# EAGLE design SwitchBoard_MP3 (EAGLE 9.6.2)
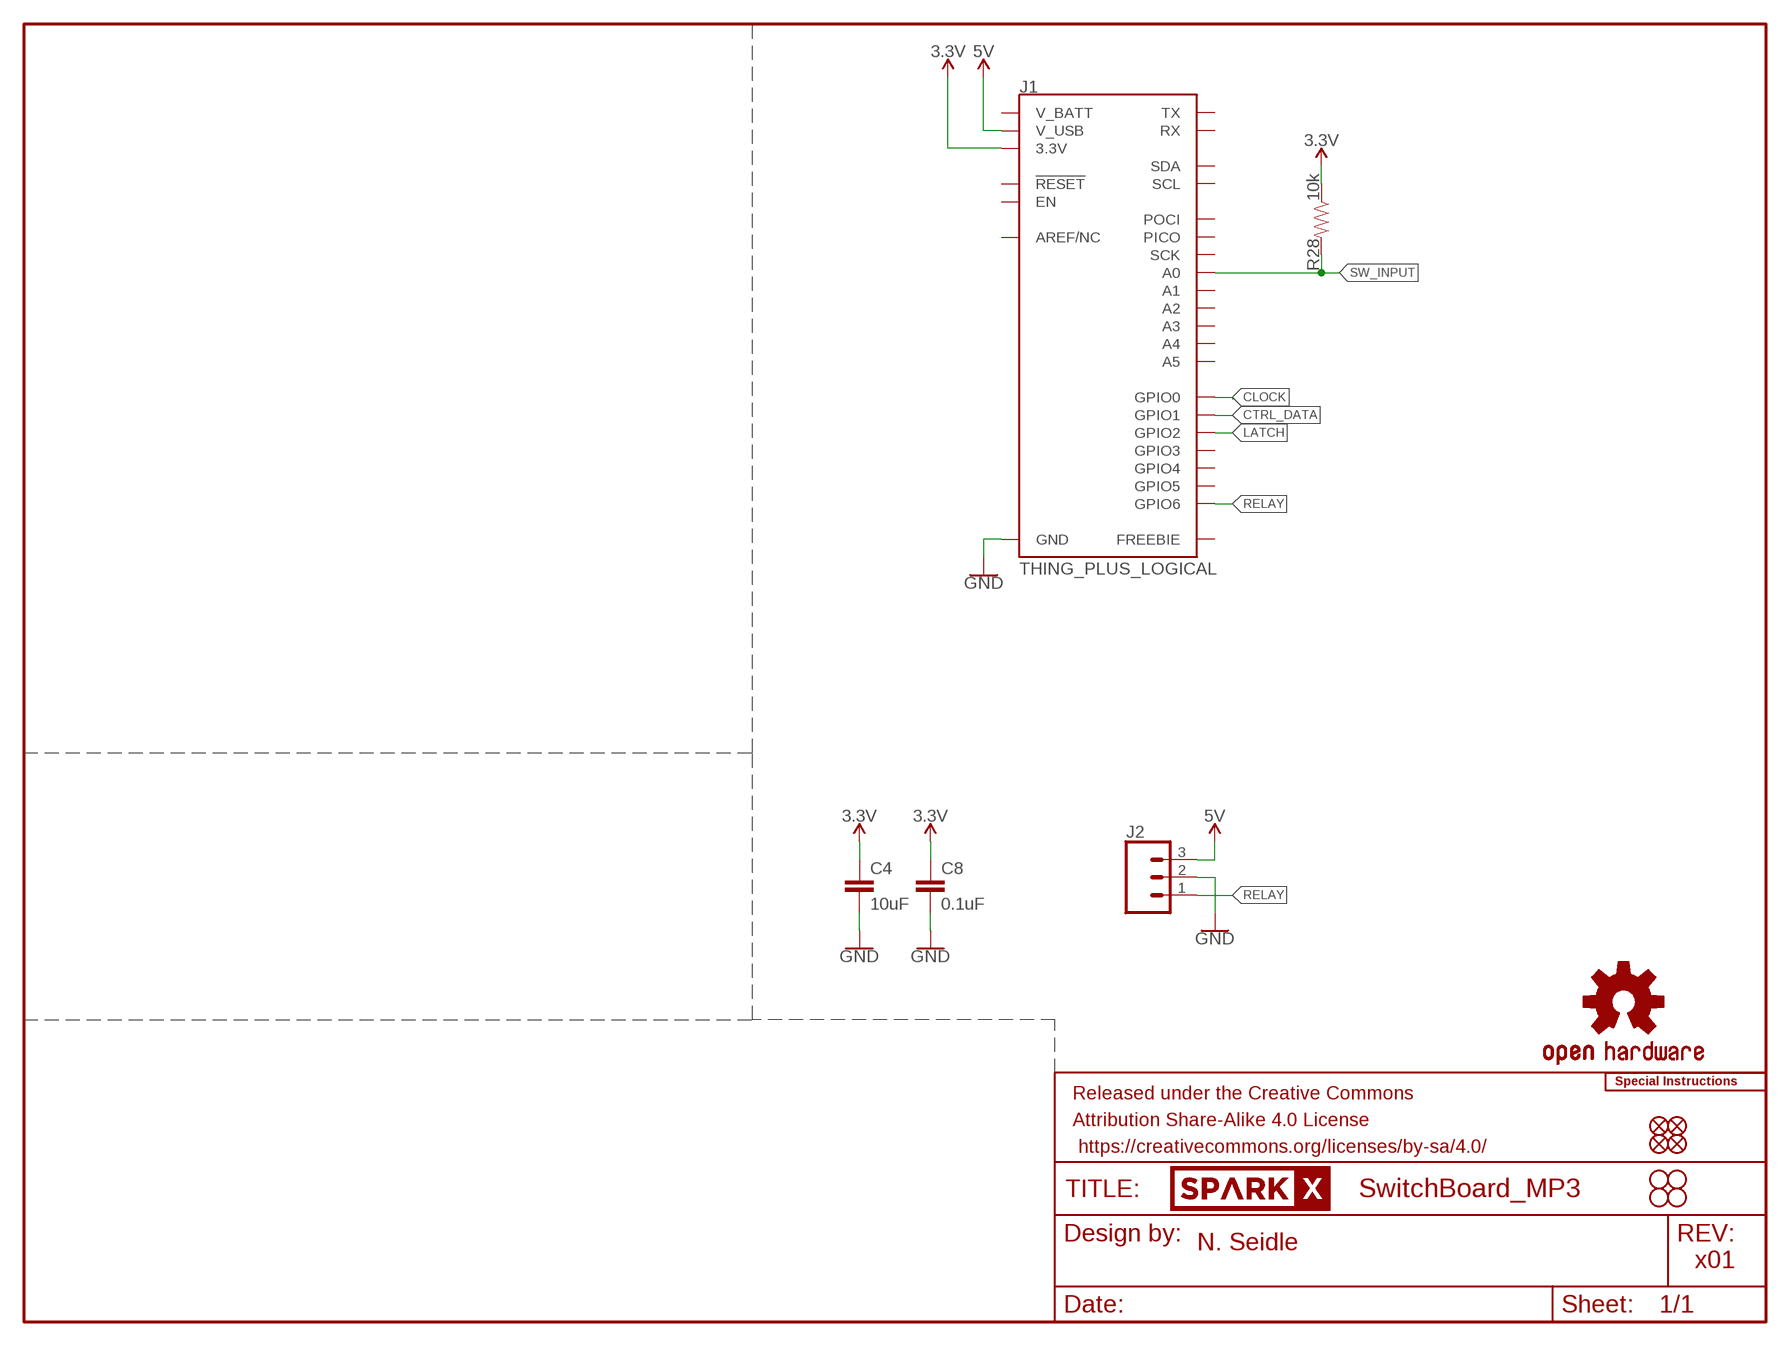
[diagram p0: schematic, sheet 1, part 1 of 2]
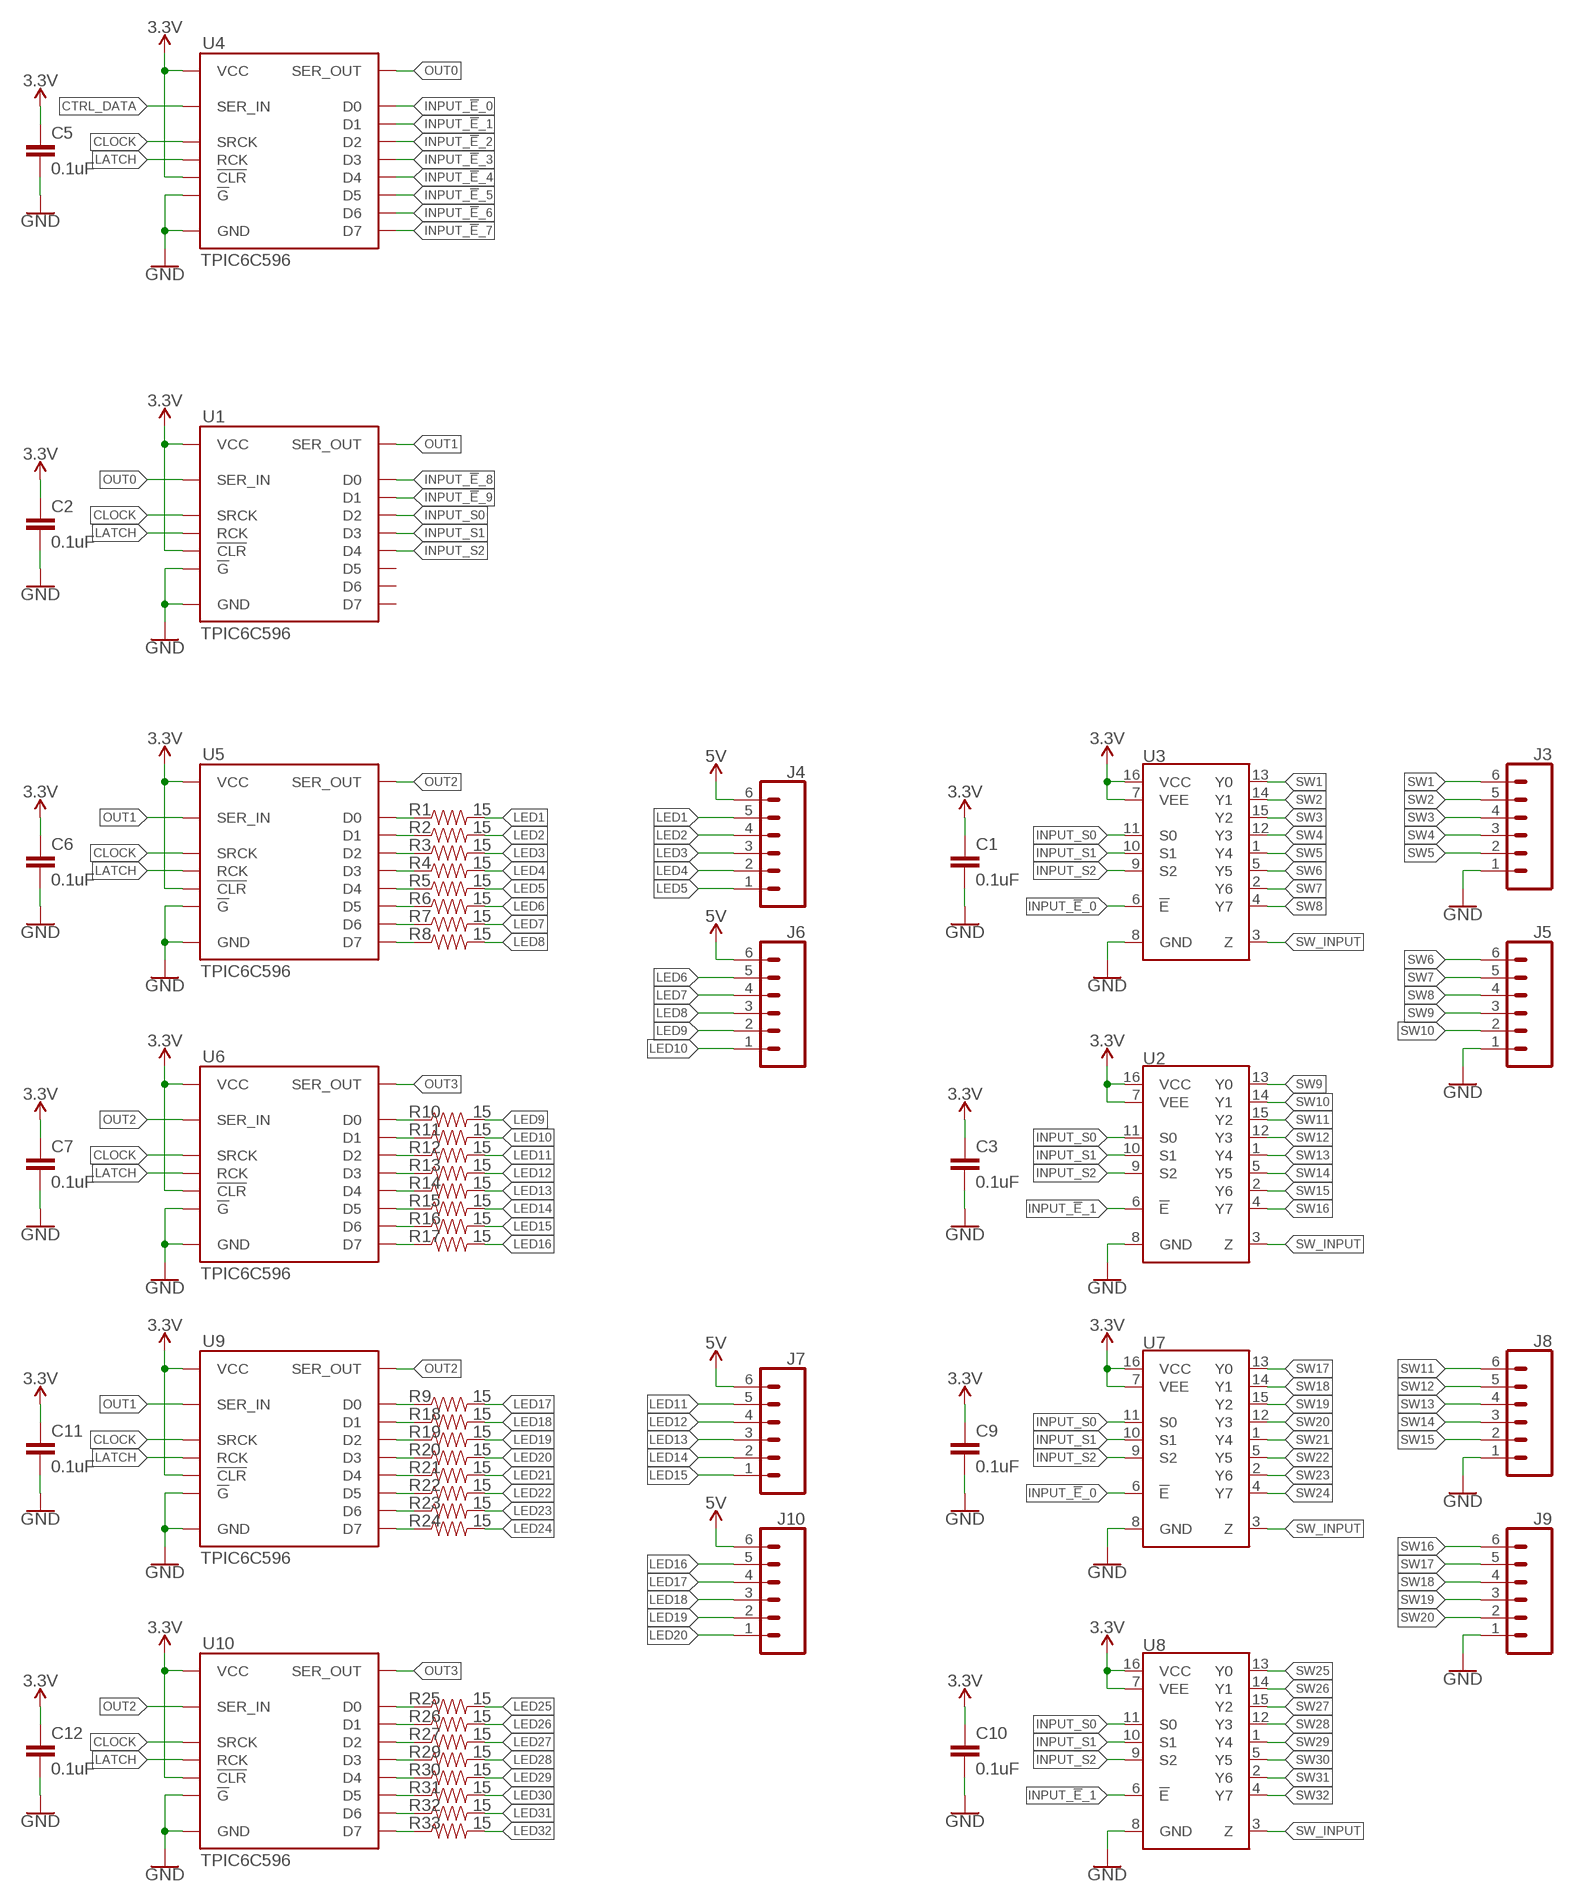
[diagram p1: schematic, sheet 1, part 2 of 2]

## Parts
C1  0.1uF  0.1UF-0603-25V-10%-X7R-WE  [0603]
C2  0.1uF  0.1UF-0603-25V-10%-X7R-WE  [0603]
C3  0.1uF  0.1UF-0603-25V-10%-X7R-WE  [0603]
C4  10uF  10UF-0805-25V-10%  [0805]
C5  0.1uF  0.1UF-0603-25V-10%-X7R-WE  [0603]
C6  0.1uF  0.1UF-0603-25V-10%-X7R-WE  [0603]
C7  0.1uF  0.1UF-0603-25V-10%-X7R-WE  [0603]
C8  0.1uF  0.1UF-0603-25V-10%-X7R-WE  [0603]
C9  0.1uF  0.1UF-0603-25V-10%-X7R-WE  [0603]
C10  0.1uF  0.1UF-0603-25V-10%-X7R-WE  [0603]
C11  0.1uF  0.1UF-0603-25V-10%-X7R-WE  [0603]
C12  0.1uF  0.1UF-0603-25V-10%-X7R-WE  [0603]
FD1  FIDUCIAL1X2  [FIDUCIAL-1X2]
FD2  FIDUCIAL1X2  [FIDUCIAL-1X2]
FD3  FIDUCIAL1X2  [FIDUCIAL-1X2]
FD4  FIDUCIAL1X2  [FIDUCIAL-1X2]
FRAME1  FRAME-LETTER  [CREATIVE_COMMONS]
H1  STAND-OFF  [STAND-OFF]
H2  STAND-OFF  [STAND-OFF]
H3  STAND-OFF  [STAND-OFF]
H4  STAND-OFF  [STAND-OFF]
J1  THING_PLUS_LOGICAL  [THING_PLUS]
J2  CONN_03JST-PTH-NS  [JST-3-PTH-NS]
J3  CONN_06JST-SMD-LOCKING  [JST-6-SMD-1.25MM-LOCKING]
J4  CONN_06JST-SMD-LOCKING  [JST-6-SMD-1.25MM-LOCKING]
J5  CONN_06JST-SMD-LOCKING  [JST-6-SMD-1.25MM-LOCKING]
J6  CONN_06JST-SMD-LOCKING  [JST-6-SMD-1.25MM-LOCKING]
J7  CONN_06JST-SMD-LOCKING  [JST-6-SMD-1.25MM-LOCKING]
J8  CONN_06JST-SMD-LOCKING  [JST-6-SMD-1.25MM-LOCKING]
J9  CONN_06JST-SMD-LOCKING  [JST-6-SMD-1.25MM-LOCKING]
J10  CONN_06JST-SMD-LOCKING  [JST-6-SMD-1.25MM-LOCKING]
LOGO1  SPECIAL_INSTRUCTIONS-ORDERING  [ORDERING_INSTRUCTIONS]
LOGO2  OSHW-LOGOS  [OSHW-LOGO-S]
R1  15  15OHM-0603-1/10W-1%  [0603]
R2  15  15OHM-0603-1/10W-1%  [0603]
R3  15  15OHM-0603-1/10W-1%  [0603]
R4  15  15OHM-0603-1/10W-1%  [0603]
R5  15  15OHM-0603-1/10W-1%  [0603]
R6  15  15OHM-0603-1/10W-1%  [0603]
R7  15  15OHM-0603-1/10W-1%  [0603]
R8  15  15OHM-0603-1/10W-1%  [0603]
R9  15  15OHM-0603-1/10W-1%  [0603]
R10  15  15OHM-0603-1/10W-1%  [0603]
R11  15  15OHM-0603-1/10W-1%  [0603]
R12  15  15OHM-0603-1/10W-1%  [0603]
R13  15  15OHM-0603-1/10W-1%  [0603]
R14  15  15OHM-0603-1/10W-1%  [0603]
R15  15  15OHM-0603-1/10W-1%  [0603]
R16  15  15OHM-0603-1/10W-1%  [0603]
R17  15  15OHM-0603-1/10W-1%  [0603]
R18  15  15OHM-0603-1/10W-1%  [0603]
R19  15  15OHM-0603-1/10W-1%  [0603]
R20  15  15OHM-0603-1/10W-1%  [0603]
R21  15  15OHM-0603-1/10W-1%  [0603]
R22  15  15OHM-0603-1/10W-1%  [0603]
R23  15  15OHM-0603-1/10W-1%  [0603]
R24  15  15OHM-0603-1/10W-1%  [0603]
R25  15  15OHM-0603-1/10W-1%  [0603]
R26  15  15OHM-0603-1/10W-1%  [0603]
R27  15  15OHM-0603-1/10W-1%  [0603]
R28  10k  10KOHM-0603-1/10W-1%  [0603]
R29  15  15OHM-0603-1/10W-1%  [0603]
R30  15  15OHM-0603-1/10W-1%  [0603]
R31  15  15OHM-0603-1/10W-1%  [0603]
R32  15  15OHM-0603-1/10W-1%  [0603]
R33  15  15OHM-0603-1/10W-1%  [0603]
U1  TPIC6C596  TPIC6C596SOIC  [SO016]
U2  744051  [SO16]
U3  744051  [SO16]
U4  TPIC6C596  TPIC6C596SOIC  [SO016]
U5  TPIC6C596  TPIC6C596SOIC  [SO016]
U6  TPIC6C596  TPIC6C596SOIC  [SO016]
U7  744051  [SO16]
U8  744051  [SO16]
U9  TPIC6C596  TPIC6C596SOIC  [SO016]
U10  TPIC6C596  TPIC6C596SOIC  [SO016]
U$1  SPARKX-LOGO4  [SPARKX-MEDIUM]

## Nets
3.3V: C1.1 C2.1 C3.1 C4.1 C5.1 C6.1 C7.1 C8.1 C9.1 C10.1 C11.1 C12.1 J1.27(3.3V) R28.1 U1.1(VCC) U1.7(!CLR) U2.7(VEE) U2.16(VCC) U3.7(VEE) U3.16(VCC) U4.1(VCC) U4.7(!CLR) U5.1(VCC) U5.7(!CLR) U6.1(VCC) U6.7(!CLR) U7.7(VEE) U7.16(VCC) U8.7(VEE) U8.16(VCC) U9.1(VCC) U9.7(!CLR) U10.1(VCC) U10.7(!CLR)
5V: J1.10(V_USB) J2.3 J4.6 J6.6 J7.6 J10.6
CLOCK: J1.9(GPIO0) U1.15(SRCK) U4.15(SRCK) U5.15(SRCK) U6.15(SRCK) U9.15(SRCK) U10.15(SRCK)
CTRL_DATA: J1.8(GPIO1) U4.2(SER_IN)
GND: C1.2 C2.2 C3.2 C4.2 C5.2 C6.2 C7.2 C8.2 C9.2 C10.2 C11.2 C12.2 J1.25(GND) J2.2 J3.1 J5.1 J8.1 J9.1 U1.8(!G) U1.16(GND) U2.8(GND) U3.8(GND) U4.8(!G) U4.16(GND) U5.8(!G) U5.16(GND) U6.8(!G) U6.16(GND) U7.8(GND) U8.8(GND) U9.8(!G) U9.16(GND) U10.8(!G) U10.16(GND)
INPUT_!E!_0: U3.6(!E!) U4.3(D0) U7.6(!E!)
INPUT_!E!_1: U2.6(!E!) U4.4(D1) U8.6(!E!)
INPUT_!E!_2: U4.5(D2)
INPUT_!E!_3: U4.6(D3)
INPUT_!E!_4: U4.11(D4)
INPUT_!E!_5: U4.12(D5)
INPUT_!E!_6: U4.13(D6)
INPUT_!E!_7: U4.14(D7)
INPUT_!E!_8: U1.3(D0)
INPUT_!E!_9: U1.4(D1)
INPUT_S0: U1.5(D2) U2.11(S0) U3.11(S0) U7.11(S0) U8.11(S0)
INPUT_S1: U1.6(D3) U2.10(S1) U3.10(S1) U7.10(S1) U8.10(S1)
INPUT_S2: U1.11(D4) U2.9(S2) U3.9(S2) U7.9(S2) U8.9(S2)
LATCH: J1.7(GPIO2) U1.10(RCK) U4.10(RCK) U5.10(RCK) U6.10(RCK) U9.10(RCK) U10.10(RCK)
LED1: J4.5 R1.2
LED2: J4.4 R2.2
LED3: J4.3 R3.2
LED4: J4.2 R4.2
LED5: J4.1 R5.2
LED6: J6.5 R6.2
LED7: J6.4 R7.2
LED8: J6.3 R8.2
LED9: J6.2 R10.2
LED10: J6.1 R11.2
LED11: J7.5 R12.2
LED12: J7.4 R13.2
LED13: J7.3 R14.2
LED14: J7.2 R15.2
LED15: J7.1 R16.2
LED16: J10.5 R17.2
LED17: J10.4 R9.2
LED18: J10.3 R18.2
LED19: J10.2 R19.2
LED20: J10.1 R20.2
LED21: R21.2
LED22: R22.2
LED23: R23.2
LED24: R24.2
LED25: R25.2
LED26: R26.2
LED27: R27.2
LED28: R29.2
LED29: R30.2
LED30: R31.2
LED31: R32.2
LED32: R33.2
N$1: R1.1 U5.3(D0)
N$2: R2.1 U5.4(D1)
N$3: R3.1 U5.5(D2)
N$4: R4.1 U5.6(D3)
N$5: R5.1 U5.11(D4)
N$6: R6.1 U5.12(D5)
N$7: R7.1 U5.13(D6)
N$8: R8.1 U5.14(D7)
N$9: R9.1 U9.3(D0)
N$10: R10.1 U6.3(D0)
N$11: R11.1 U6.4(D1)
N$12: R12.1 U6.5(D2)
N$13: R13.1 U6.6(D3)
N$14: R14.1 U6.11(D4)
N$15: R15.1 U6.12(D5)
N$16: R16.1 U6.13(D6)
N$17: R17.1 U6.14(D7)
N$18: R18.1 U9.4(D1)
N$19: R19.1 U9.5(D2)
N$20: R20.1 U9.6(D3)
N$21: R21.1 U9.11(D4)
N$22: R22.1 U9.12(D5)
N$23: R23.1 U9.13(D6)
N$24: R24.1 U9.14(D7)
N$25: R25.1 U10.3(D0)
N$26: R26.1 U10.4(D1)
N$27: R27.1 U10.5(D2)
N$28: R29.1 U10.6(D3)
N$29: R30.1 U10.11(D4)
N$30: R31.1 U10.12(D5)
N$31: R32.1 U10.13(D6)
N$32: R33.1 U10.14(D7)
OUT0: U1.2(SER_IN) U4.9(SER_OUT)
OUT1: U1.9(SER_OUT) U5.2(SER_IN) U9.2(SER_IN)
OUT2: U5.9(SER_OUT) U6.2(SER_IN) U9.9(SER_OUT) U10.2(SER_IN)
OUT3: U6.9(SER_OUT) U10.9(SER_OUT)
RELAY: J1.3(GPIO6) J2.1
SW1: J3.6 U3.13(Y0)
SW2: J3.5 U3.14(Y1)
SW3: J3.4 U3.15(Y2)
SW4: J3.3 U3.12(Y3)
SW5: J3.2 U3.1(Y4)
SW6: J5.6 U3.5(Y5)
SW7: J5.5 U3.2(Y6)
SW8: J5.4 U3.4(Y7)
SW9: J5.3 U2.13(Y0)
SW10: J5.2 U2.14(Y1)
SW11: J8.6 U2.15(Y2)
SW12: J8.5 U2.12(Y3)
SW13: J8.4 U2.1(Y4)
SW14: J8.3 U2.5(Y5)
SW15: J8.2 U2.2(Y6)
SW16: J9.6 U2.4(Y7)
SW17: J9.5 U7.13(Y0)
SW18: J9.4 U7.14(Y1)
SW19: J9.3 U7.15(Y2)
SW20: J9.2 U7.12(Y3)
SW21: U7.1(Y4)
SW22: U7.5(Y5)
SW23: U7.2(Y6)
SW24: U7.4(Y7)
SW25: U8.13(Y0)
SW26: U8.14(Y1)
SW27: U8.15(Y2)
SW28: U8.12(Y3)
SW29: U8.1(Y4)
SW30: U8.5(Y5)
SW31: U8.2(Y6)
SW32: U8.4(Y7)
SW_INPUT: J1.24(A0) R28.2 U2.3(Z) U3.3(Z) U7.3(Z) U8.3(Z)
Unconnected: J1.1(SDA) J1.2(SCL) J1.4(GPIO5) J1.5(GPIO4) J1.6(GPIO3) J1.11(EN) J1.12(V_BATT) J1.13(FREEBIE) J1.14(TX) J1.15(RX) J1.16(POCI) J1.17(PICO) J1.18(SCK) J1.19(A5) J1.20(A4) J1.21(A3) J1.22(A2) J1.23(A1) J1.26(AREF/NC) J1.28(!RESET) U1.12(D5) U1.13(D6) U1.14(D7)

## Notes on the sheet
- N. Seidle
- x01

## Library data of the parts
C1-C3 C5-C12 = SparkFun-Capacitors:0.1UF: 0.1µF ceramic capacitors A capacitor is a passive two-terminal electrical component used to store electrical energy temporarily in an electric field.; PROD_ID: CAP-16503
C4 = SparkFun-Capacitors:10UF: 10.0µF ceramic capacitors A capacitor is a passive two-terminal electrical component used to store electrical energy temporarily in an electric field.; PROD_ID: CAP-14259
FD1-FD4 = SparkFun-Aesthetics:FIDUCIAL: Fiducial Alignment Points Point-of-reference for pick-and-place machines and other optical instruments.
FRAME1 = SparkFun-Aesthetics:FRAME-LETTER: Schematic Frame - Letter Standard 8.5x11 US Letter frame
H1-H4 = SparkFun-Hardware:STAND-OFF: Stand Off Drill holes for mechanically mounting via screws, standoffs, etc. Note: Use the keepout ring to avoid running the screw head into surrounding components. Variant Overviews STAND-OFF - Mechanical footprint for a #4 phillips button head screw. STAND-OFF-TIGHT - Mechanical footprint for a #4 phillips button head screw, Example SparkFun Products Screw - Phillips Head (1/4", 4-40, 10 pack) <https://www.sparkfun.com/products/10453> (PRT-10453) Screw - Phillips Head (1/2", 4-40, 10 pack) <https://www.sparkfun.com/products/10452> (PRT-10452) Screw - Phillips Head (3/4", 4-40, 10 pack) <https://www.sparkfun.com/products/10451> (PRT-10451) Screw - Phillips Head (1", 4-40, 10 pack) <https://www.sparkfun.com/products/10450> (PRT-10450)
J1 = SparkFun-Boards:THING_PLUS_LOGICAL
J2 = SparkFun-Connectors:CONN_03: Multi connection point. Often used as Generic Header-pin footprint for 0.1 inch spaced/style header connections On any of the 0.1 inch spaced packages, you can populate with these: Break Away Headers - Straight <https://www.sparkfun.com/products/116> (PRT-00116) Break Away Male Headers - Right Angle <https://www.sparkfun.com/products/553> (PRT-00553) Female Headers <https://www.sparkfun.com/products/115> (PRT-00115) Break Away Headers - Machine Pin <https://www.sparkfun.com/products/117> (PRT-00117) Break Away Female Headers - Swiss Machine Pin <https://www.sparkfun.com/products/743> (PRT-00743) Stackable Header - 3 Pin (Female, 0.1") <https://www.sparkfun.com/products/13875> (PRT-13875) For SCREWTERMINALS and SPRING TERMINALS visit here: Screw Terimnals on SparkFun.com <https://www.sparkfun.com/search/results?term=Screw+Terminals> (5mm/3.5mm/2.54mm spacing) This device is also useful as a general connection point to wire up your design to another part of your project. Our various solder wires solder well into these plated through hole pads. Hook-Up Wire - Assortment (Stranded, 22 AWG) <https://www.sparkfun.com/products/11375> (PRT-11375) Hook-Up Wire - Assortment (Solid Core, 22 AWG) <https://www.sparkfun.com/products/11367> (PRT-11367) View the entire wire category on our website here <https://www.sparkfun.com/categories/141> Special notes: Molex polarized connector foot print use with SKU : PRT-08232 with associated crimp pins and housings.
J3-J10 = SparkFun-Connectors:CONN_06: Multi connection point. Often used as Generic Header-pin footprint for 0.1 inch spaced/style header connections On any of the 0.1 inch spaced packages, you can populate with these: Break Away Headers - Straight <https://www.sparkfun.com/products/116> (PRT-00116) Break Away Male Headers - Right Angle <https://www.sparkfun.com/products/553> (PRT-00553) Female Headers <https://www.sparkfun.com/products/115> (PRT-00115) Break Away Headers - Machine Pin <https://www.sparkfun.com/products/117> (PRT-00117) Break Away Female Headers - Swiss Machine Pin <https://www.sparkfun.com/products/743> (PRT-00743) Arduino Stackable Header - 6 Pin <https://www.sparkfun.com/products/9280> (PRT-09280) Screw Terminals 2.54mm Pitch (6-Pin) <https://www.sparkfun.com/products/16499> (PRT-16499) For SCREWTERMINALS and SPRING TERMINALS visit here: Screw Terimnals on SparkFun.com <https://www.sparkfun.com/search/results?term=Screw+Terminals> (5mm/3.5mm/2.54mm spacing) This device is also useful as a general connection point to wire up your design to another part of your project. Our various solder wires solder well into these plated through hole pads. Hook-Up Wire - Assortment (Stranded, 22 AWG) <https://www.sparkfun.com/products/11375> (PRT-11375) Hook-Up Wire - Assortment (Solid Core, 22 AWG) <https://www.sparkfun.com/products/11367> (PRT-11367) View the entire wire category on our website here <https://www.sparkfun.com/categories/141>; PROD_ID: CONN-16497
LOGO1 = SparkFun-Aesthetics:SPECIAL_INSTRUCTIONS: Special Ordering/Production Instructions Alert Symbol for special PCB ordering instructions or unique production process warnings. Ordering Instructions Production Instructions Types of information that should be added to box: Copper weight Soldermask color Silk color PCB thickness Number of layers PCB Standard: 1.6mm FR4 1 oz copper immersion silver plating red soldermask white silkscreen Types of information that should be added to box: Special wash requirements Depaneling instructions Humidification Glue curing Default text settings: 0.07 inch 9% ratio 50% line distance
LOGO2 = SparkFun-Aesthetics:OSHW-LOGO: Open-Source Hardware (OSHW) Logo This logo indicates the piece of hardware it is found on incorporates a OSHW license and/or adheres to the definition of open source hardware found here: http://freedomdefined.org/OSHW
R1-R27 R29-R33 = SparkFun-Resistors:15OHM: 15Ω resistor A resistor is a passive two-terminal electrical component that implements electrical resistance as a circuit element. Resistors act to reduce current flow, and, at the same time, act to lower voltage levels within circuits. - Wikipedia; PROD_ID: RES-12570
R28 = SparkFun-Resistors:10KOHM: 10kΩ resistor A resistor is a passive two-terminal electrical component that implements electrical resistance as a circuit element. Resistors act to reduce current flow, and, at the same time, act to lower voltage levels within circuits. - Wikipedia; PROD_ID: RES-00824
U1 U4-U6 U9 U10 = SparkFun-DigitalIC:TPIC6C596: SMD version of the popular sink driver. This version can sink up to 100mA per channel; PROD_ID: IC-12522
U2 U3 U7 U8 = AnalogMux:74*4051: NXP 74HC4051 8-Channel Analog Multiplexer/Demultiplexer The 74HC4051; 74HCT4051 is a single-pole octal-throw analog switch (SP8T) suitable for use in analog or digital 8:1 multiplexer/demultiplexer applications. The switch features three digital select inputs (S0, S1 and S2), eight independent inputs/outputs (Yn), a common input/output (Z) and a digital enable input (E). When E is HIGH, the switches are turned off. Inputs include clamp diodes. This enables the use of current limiting resistors to interface inputs to voltages in excess of VCC. Datasheet <http://www.nxp.com/documents/data_sheet/74HC_HCT4051.pdf>
U$1 = SparkX:SPARKX-LOGO

## Net classes
1 power: width 0.254 mm

## Board
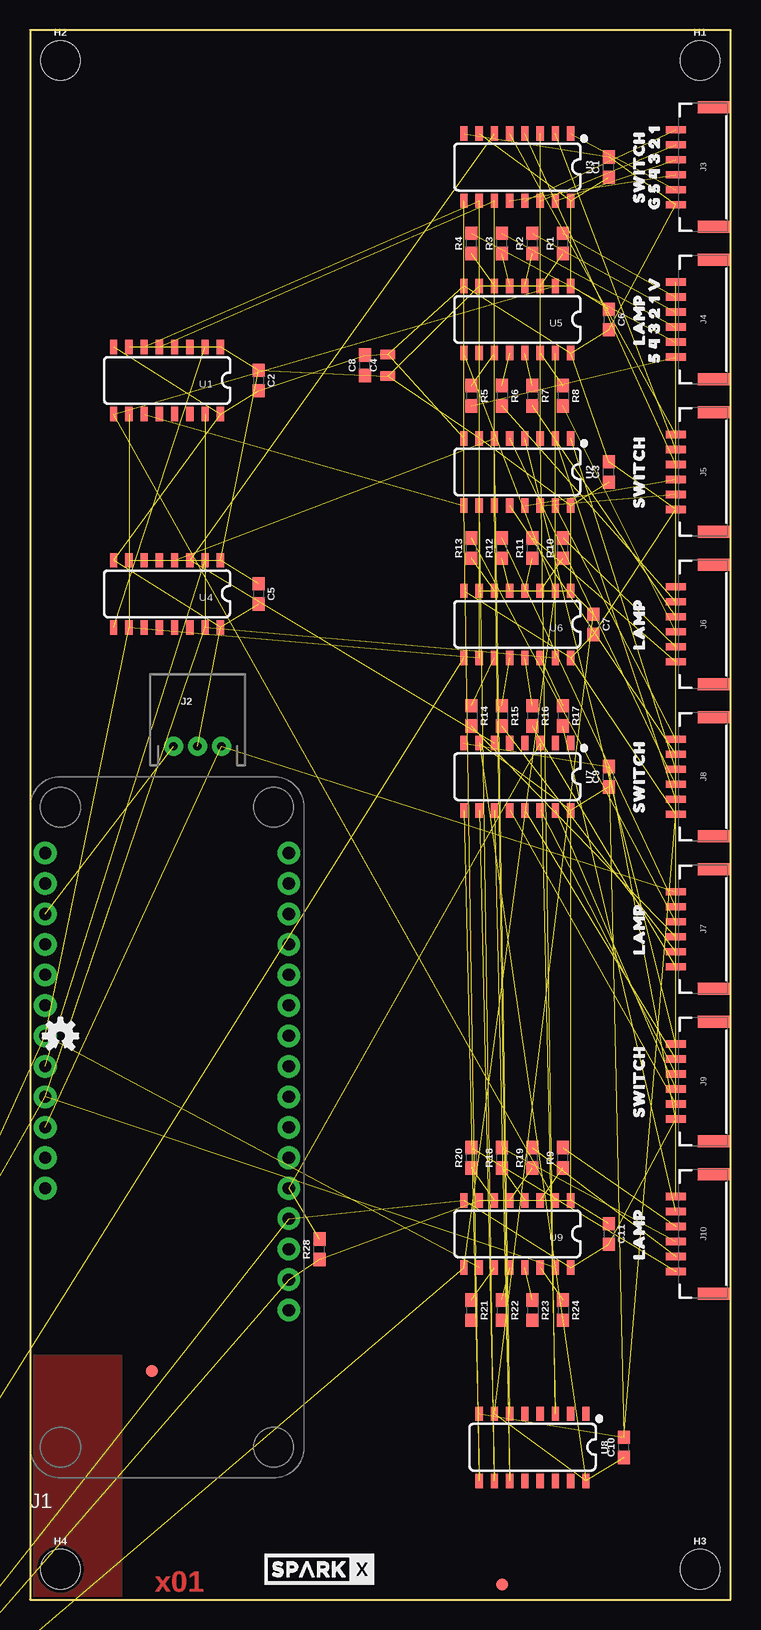
[diagram p2: board, top side]
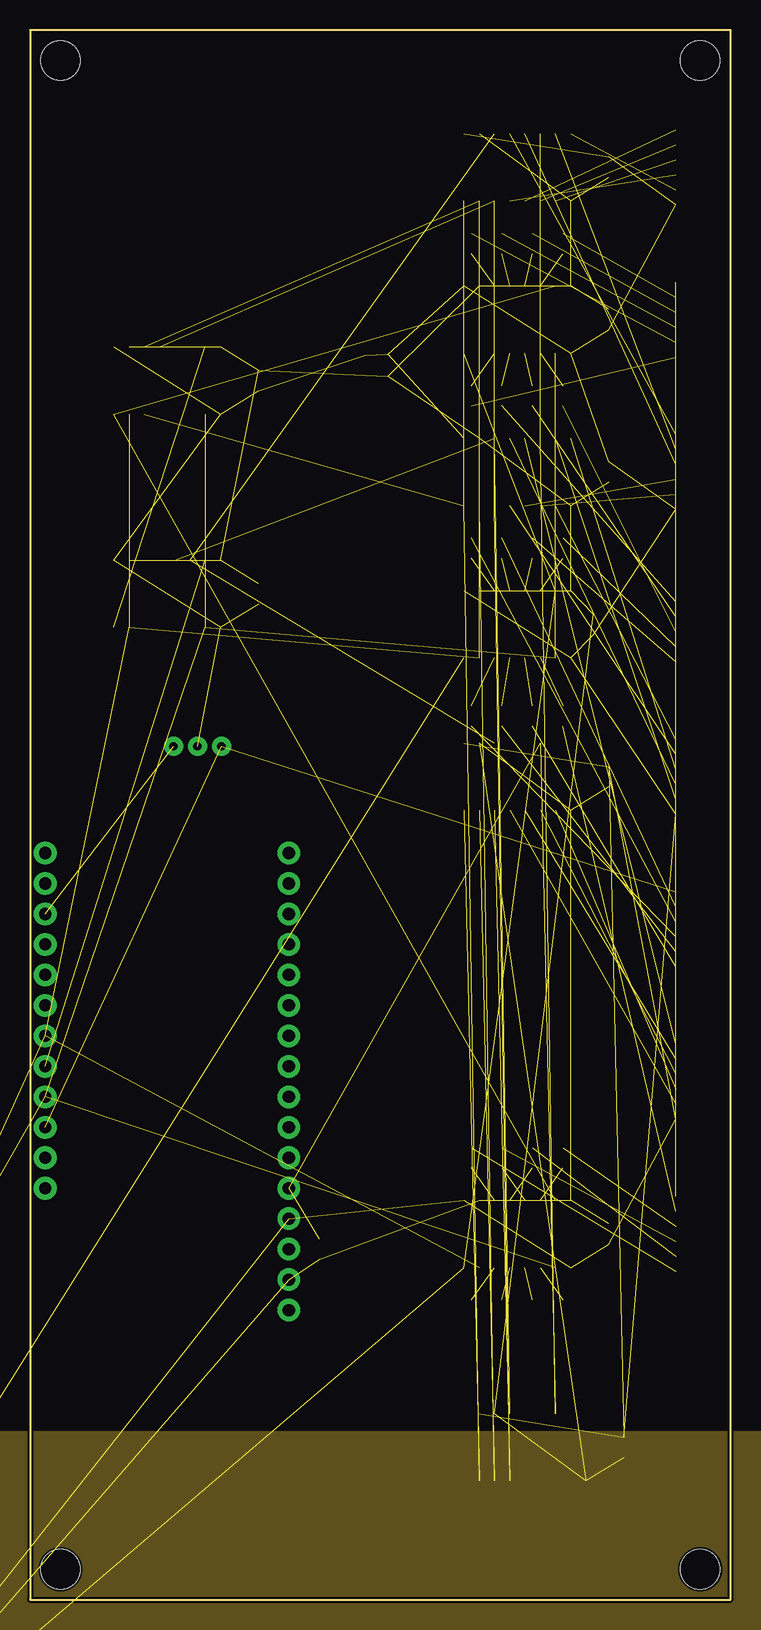
[diagram p3: board, inner layer Route2]
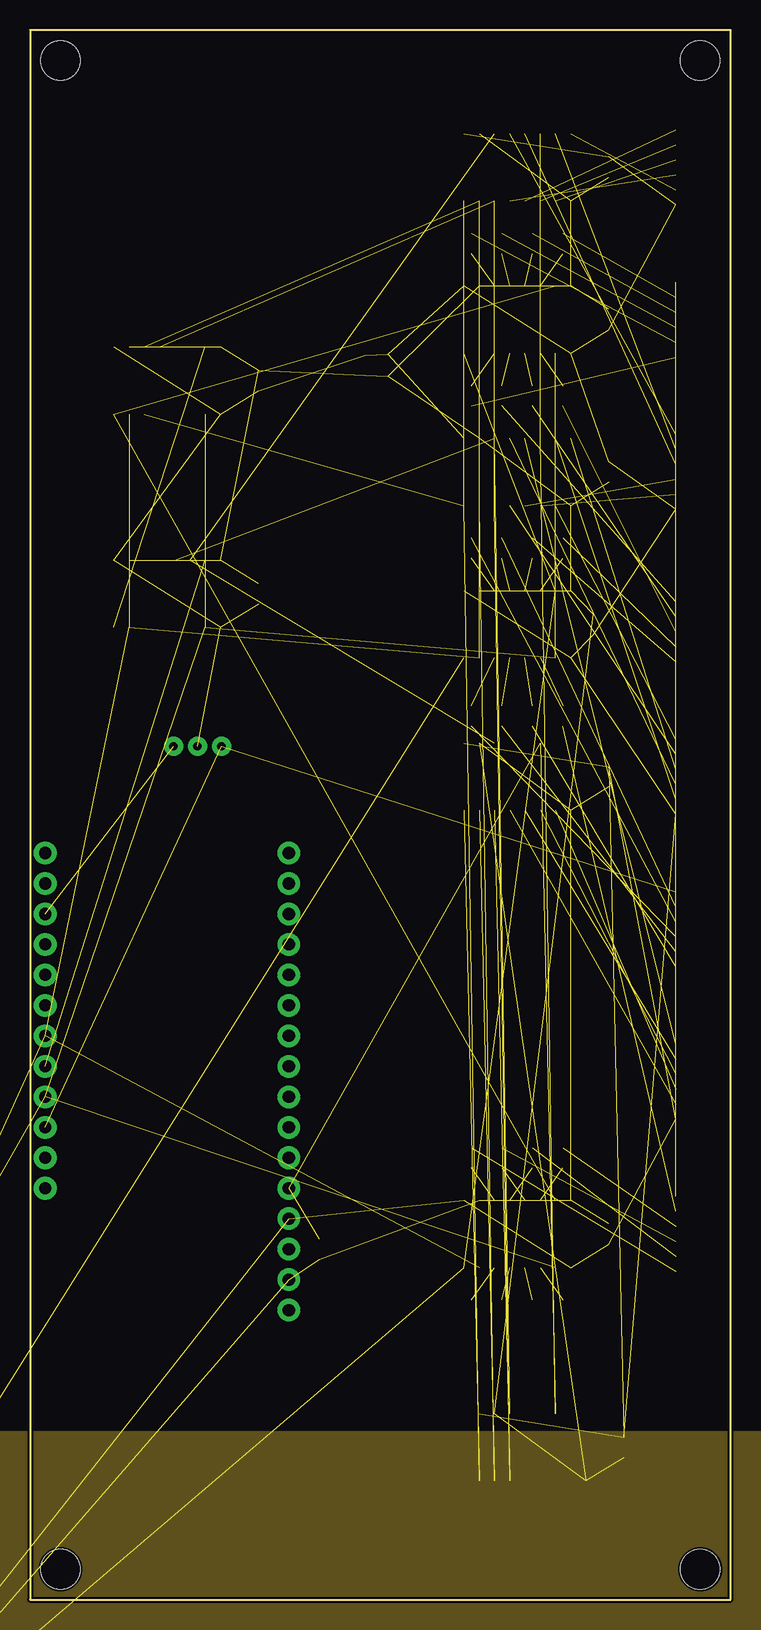
[diagram p4: board, inner layer Route15]
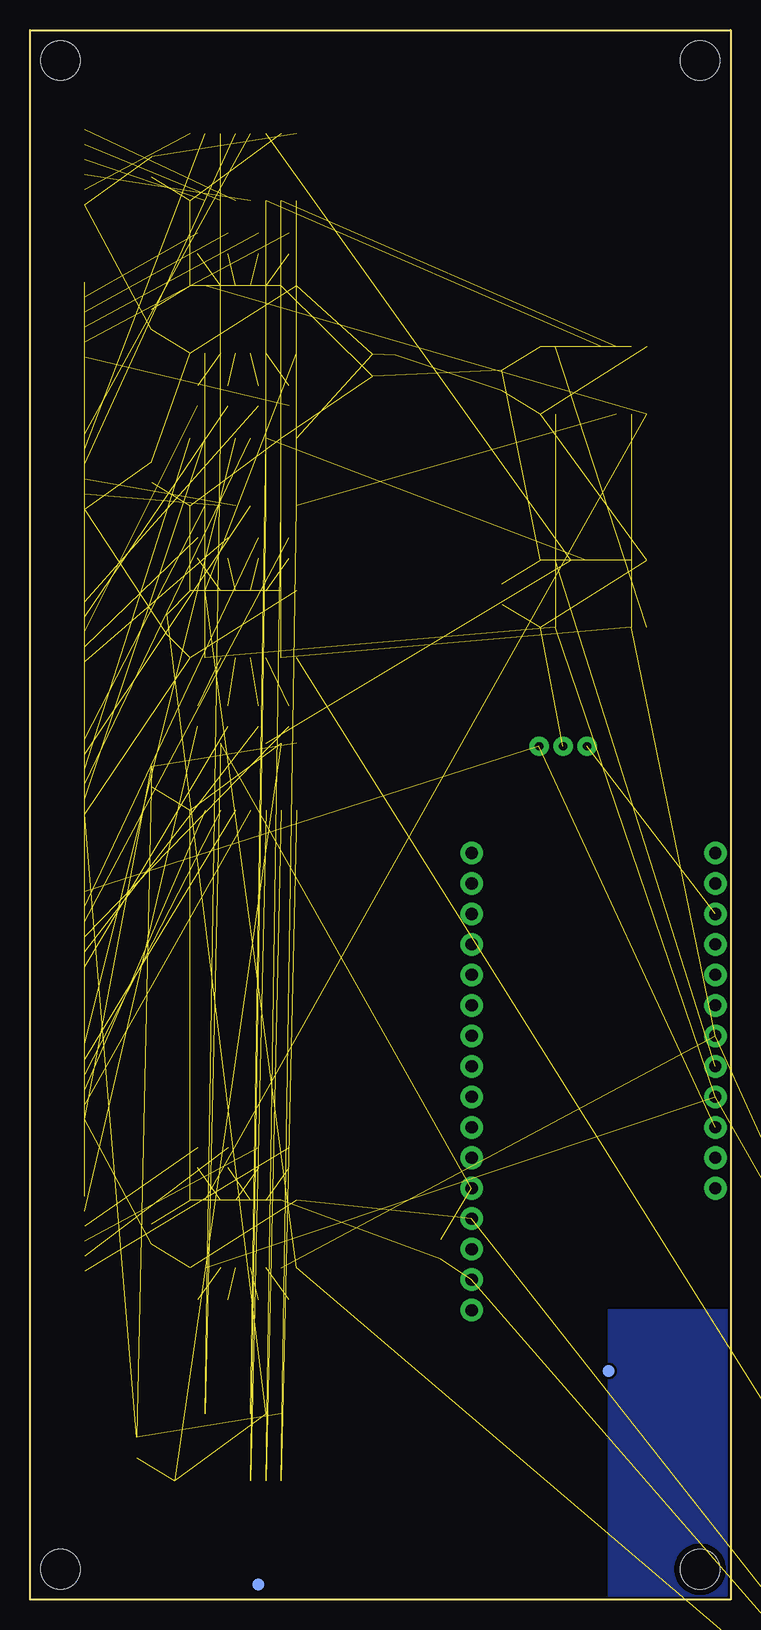
[diagram p5: board, bottom side, seen from below]

Size 58.42 x 130.81 mm. Coordinates in mm from the lower left corner, seen from the top.
Outline: 0,0 58.42,0 58.42,130.81 0,130.81 0,0
Copper layers (1*2*15*16): Top 0.035559375mm / dielectric 0.47751875mm / Route2 0.035559375mm / dielectric 0.47751875mm / Route15 0.035559375mm / dielectric 0.47751875mm / Bottom 0.035559375mm
Design rules "SparkFun-4-Layer-Minimum-JLCPCB": minimum track width 5mil, minimum drill 0.2mm, track to track 5mil, track to pad 5mil, pad to pad 5mil, via to via 5mil, smd to smd 5mil, copper to edge 7mil, drill to drill 7mil, minimum pad ring 5mil, minimum via ring 5mil, stop-mask expansion 2.5mil, vias tented up to drill 25mil, thermal gap 10mil

### Footprints (pad centres in the part's own frame; a part is rotated, then mirrored left to right if it is on the bottom)
0603 = smd 1.1 x 1: 1 -0.85,0; 2 0.85,0
0805 = smd 0.8 x 1.2: 1 -0.9,0; 2 0.9,0
FIDUCIAL-1X2 = smd 1 x 1: 1 0,0
STAND-OFF = hole 3.302: 0,0
THING_PLUS = drill 1.016 pad 1.88: 1 1.27,52.07; 2 1.27,49.53; 3 1.27,46.99; 4 1.27,44.45; 5 1.27,41.91; 6 1.27,39.37; 7 1.27,36.83; 8 1.27,34.29; 9 1.27,31.75; 10 1.27,29.21; 11 1.27,26.67; 12 1.27,24.13; 13 21.59,52.07; 14 21.59,49.53; 15 21.59,46.99; 16 21.59,44.45; 17 21.59,41.91; 18 21.59,39.37; 19 21.59,36.83; 20 21.59,34.29; 21 21.59,31.75; 22 21.59,29.21; 23 21.59,26.67; 24 21.59,24.13; 25 21.59,21.59; 26 21.59,19.05; 27 21.59,16.51; 28 21.59,13.97
JST-3-PTH-NS = drill 0.7 pad 1.6: 1 -2,0; 2 0,0; 3 2,0
JST-6-SMD-1.25MM-LOCKING = smd 0.6 x 1.7: 1 -3.125,3.3; 2 -1.875,3.3; 3 -0.625,3.3; 4 0.625,3.3; 5 1.875,3.3; 6 3.125,3.3 | smd 1 x 2.7: NC1 4.975,0.1; NC2 -4.975,0.1
SO016 = smd 0.6 x 1.2: 1 -4.445,-2.8; 2 -3.175,-2.8; 3 -1.905,-2.8; 4 -0.635,-2.8; 5 0.635,-2.8; 6 1.905,-2.8; 7 3.175,-2.8; 8 4.445,-2.8; 9 4.445,2.8; 10 3.175,2.8; 11 1.905,2.8; 12 0.635,2.8; 13 -0.635,2.8; 14 -1.905,2.8; 15 -3.175,2.8; 16 -4.445,2.8
SO16 = smd 0.6 x 1.2: 1 -4.445,-2.8; 2 -3.175,-2.8; 3 -1.905,-2.8; 4 -0.635,-2.8; 5 0.635,-2.8; 6 1.905,-2.8; 7 3.175,-2.8; 8 4.445,-2.8; 9 4.445,2.8; 10 3.175,2.8; 11 1.905,2.8; 12 0.635,2.8; 13 -0.635,2.8; 14 -1.905,2.8; 15 -3.175,2.8; 16 -4.445,2.8

### Placement (x,y rotation side)
C1  48.26,119.38 90 top
C2  19.05,101.6 270 top
C3  48.26,93.98 90 top
C4  29.84,102.87 90 top
C5  19.05,83.82 270 top
C6  48.26,106.68 270 top
C7  46.99,81.28 270 top
C8  27.94,102.87 90 top
C9  48.26,68.58 90 top
C10  49.53,12.7 90 top
C11  48.26,30.48 270 top
C12  -45.72,-35.56 90 top  (outside the outline)
FD1  10.16,19.05 0 top
FD2  10.16,19.05 0 bottom
FD3  39.37,1.27 0 top
FD4  39.37,1.27 0 bottom
FRAME1  90.29,71.25 0 top  (outside the outline)
H1  55.88,128.27 0 top
H2  2.54,128.27 0 top
H3  55.88,2.54 0 top
H4  2.54,2.54 0 top
J1  0,10.16 0 top
J2  13.97,71.12 0 top
J3  57.15,119.38 90 top
J4  57.15,106.68 90 top
J5  57.15,93.98 90 top
J6  57.15,81.28 90 top
J7  57.15,55.88 90 top
J8  57.15,68.58 90 top
J9  57.15,43.18 90 top
J10  57.15,30.48 90 top
LOGO1  69.24,58.55 0 top  (outside the outline)
LOGO2  2.54,46.99 0 top
R1  44.45,113.03 90 top
R2  41.91,113.03 90 top
R3  39.37,113.03 90 top
R4  36.83,113.03 90 top
R5  36.83,100.33 270 top
R6  39.37,100.33 270 top
R7  41.91,100.33 270 top
R8  44.45,100.33 270 top
R9  44.45,36.83 90 top
R10  44.45,87.63 90 top
R11  41.91,87.63 90 top
R12  39.37,87.63 90 top
R13  36.83,87.63 90 top
R14  36.83,73.66 270 top
R15  39.37,73.66 270 top
R16  41.91,73.66 270 top
R17  44.45,73.66 270 top
R18  39.37,36.83 90 top
R19  41.91,36.83 90 top
R20  36.83,36.83 90 top
R21  36.83,24.13 270 top
R22  39.37,24.13 270 top
R23  41.91,24.13 270 top
R24  44.45,24.13 270 top
R25  -41.91,-41.91 270 top  (outside the outline)
R26  -39.37,-41.91 270 top  (outside the outline)
R27  -36.83,-41.91 270 top  (outside the outline)
R28  24.13,29.21 90 top
R29  -34.29,-41.91 270 top  (outside the outline)
R30  -34.29,-29.21 90 top  (outside the outline)
R31  -36.83,-29.21 90 top  (outside the outline)
R32  -39.37,-29.21 90 top  (outside the outline)
R33  -41.91,-29.21 90 top  (outside the outline)
U1  11.43,101.6 180 top
U2  40.64,93.98 180 top
U3  40.64,119.38 180 top
U4  11.43,83.82 180 top
U5  40.64,106.68 180 top
U6  40.64,81.28 180 top
U7  40.64,68.58 180 top
U8  41.91,12.7 180 top
U9  40.64,30.48 180 top
U10  -38.1,-35.56 0 top  (outside the outline)
U$1  24.13,2.54 0 top
U$2  [5_4_3_2_1_V0]  52.07,106.68 90 top
U$3  [LAMP0]  50.8,106.68 90 top
U$4  [SWITCH0]  50.8,119.38 90 top
U$5  [G_5_4_3_2_10]  52.07,119.38 90 top
U$6  [SWITCH0]  50.8,93.98 90 top
U$7  [LAMP0]  50.8,81.28 90 top
U$8  [SWITCH0]  50.8,68.58 90 top
U$9  [SWITCH0]  50.8,43.18 90 top
U$10  [SWITCH0]  63.5,76.2 90 top  (outside the outline)
U$11  [LAMP0]  50.8,55.88 90 top
U$12  [LAMP0]  50.8,30.48 90 top

### Tracks (layer width: path | path; a pad name or v marks a point on that pad's centre or on a via)
3.3V  (33 unrouted)
5V  (5 unrouted)
CLOCK  (6 unrouted)
CTRL_DATA  (1 unrouted)
GND  (33 unrouted)
  pour Bottom (isolate 0.203): 0,0 0,24.13 10.16,24.13 10.16,0
  pour Top: 0,0 0,20.32 7.62,20.32 7.62,0
  pour Route2: -81.28,-13.97 -81.28,13.97 81.28,13.97 81.28,-13.97
  pour Route15: -81.28,-13.97 -81.28,13.97 81.28,13.97 81.28,-13.97
INPUT_!E!_0  (2 unrouted)
INPUT_!E!_1  (2 unrouted)
INPUT_S0  (4 unrouted)
INPUT_S1  (4 unrouted)
INPUT_S2  (4 unrouted)
LATCH  (6 unrouted)
LED1  (1 unrouted)
LED2  (1 unrouted)
LED3  (1 unrouted)
LED4  (1 unrouted)
LED5  (1 unrouted)
LED6  (1 unrouted)
LED7  (1 unrouted)
LED8  (1 unrouted)
LED9  (1 unrouted)
LED10  (1 unrouted)
LED11  (1 unrouted)
LED12  (1 unrouted)
LED13  (1 unrouted)
LED14  (1 unrouted)
LED15  (1 unrouted)
LED16  (1 unrouted)
LED17  (1 unrouted)
LED18  (1 unrouted)
LED19  (1 unrouted)
LED20  (1 unrouted)
N$1  (1 unrouted)
N$2  (1 unrouted)
N$3  (1 unrouted)
N$4  (1 unrouted)
N$5  (1 unrouted)
N$6  (1 unrouted)
N$7  (1 unrouted)
N$8  (1 unrouted)
N$9  (1 unrouted)
N$10  (1 unrouted)
N$11  (1 unrouted)
N$12  (1 unrouted)
N$13  (1 unrouted)
N$14  (1 unrouted)
N$15  (1 unrouted)
N$16  (1 unrouted)
N$17  (1 unrouted)
N$18  (1 unrouted)
N$19  (1 unrouted)
N$20  (1 unrouted)
N$21  (1 unrouted)
N$22  (1 unrouted)
N$23  (1 unrouted)
N$24  (1 unrouted)
N$25  (1 unrouted)
N$26  (1 unrouted)
N$27  (1 unrouted)
N$28  (1 unrouted)
N$29  (1 unrouted)
N$30  (1 unrouted)
N$31  (1 unrouted)
N$32  (1 unrouted)
OUT0  (1 unrouted)
OUT1  (2 unrouted)
OUT2  (3 unrouted)
OUT3  (1 unrouted)
RELAY  (1 unrouted)
SW1  (1 unrouted)
SW2  (1 unrouted)
SW3  (1 unrouted)
SW4  (1 unrouted)
SW5  (1 unrouted)
SW6  (1 unrouted)
SW7  (1 unrouted)
SW8  (1 unrouted)
SW9  (1 unrouted)
SW10  (1 unrouted)
SW11  (1 unrouted)
SW12  (1 unrouted)
SW13  (1 unrouted)
SW14  (1 unrouted)
SW15  (1 unrouted)
SW16  (1 unrouted)
SW17  (1 unrouted)
SW18  (1 unrouted)
SW19  (1 unrouted)
SW20  (1 unrouted)
SW_INPUT  (5 unrouted)

### Text on the board
Top: x01
Measures: Dimensions in inches | PCB is slightly undersized to allow close packing
tDocu: 2-Layer PCB / 1.6mm Thickness / 1oz Copper / HASL Finish